# EAGLE design 555_projects_grove_i2c_ldr_revA (EAGLE 9.2.2)
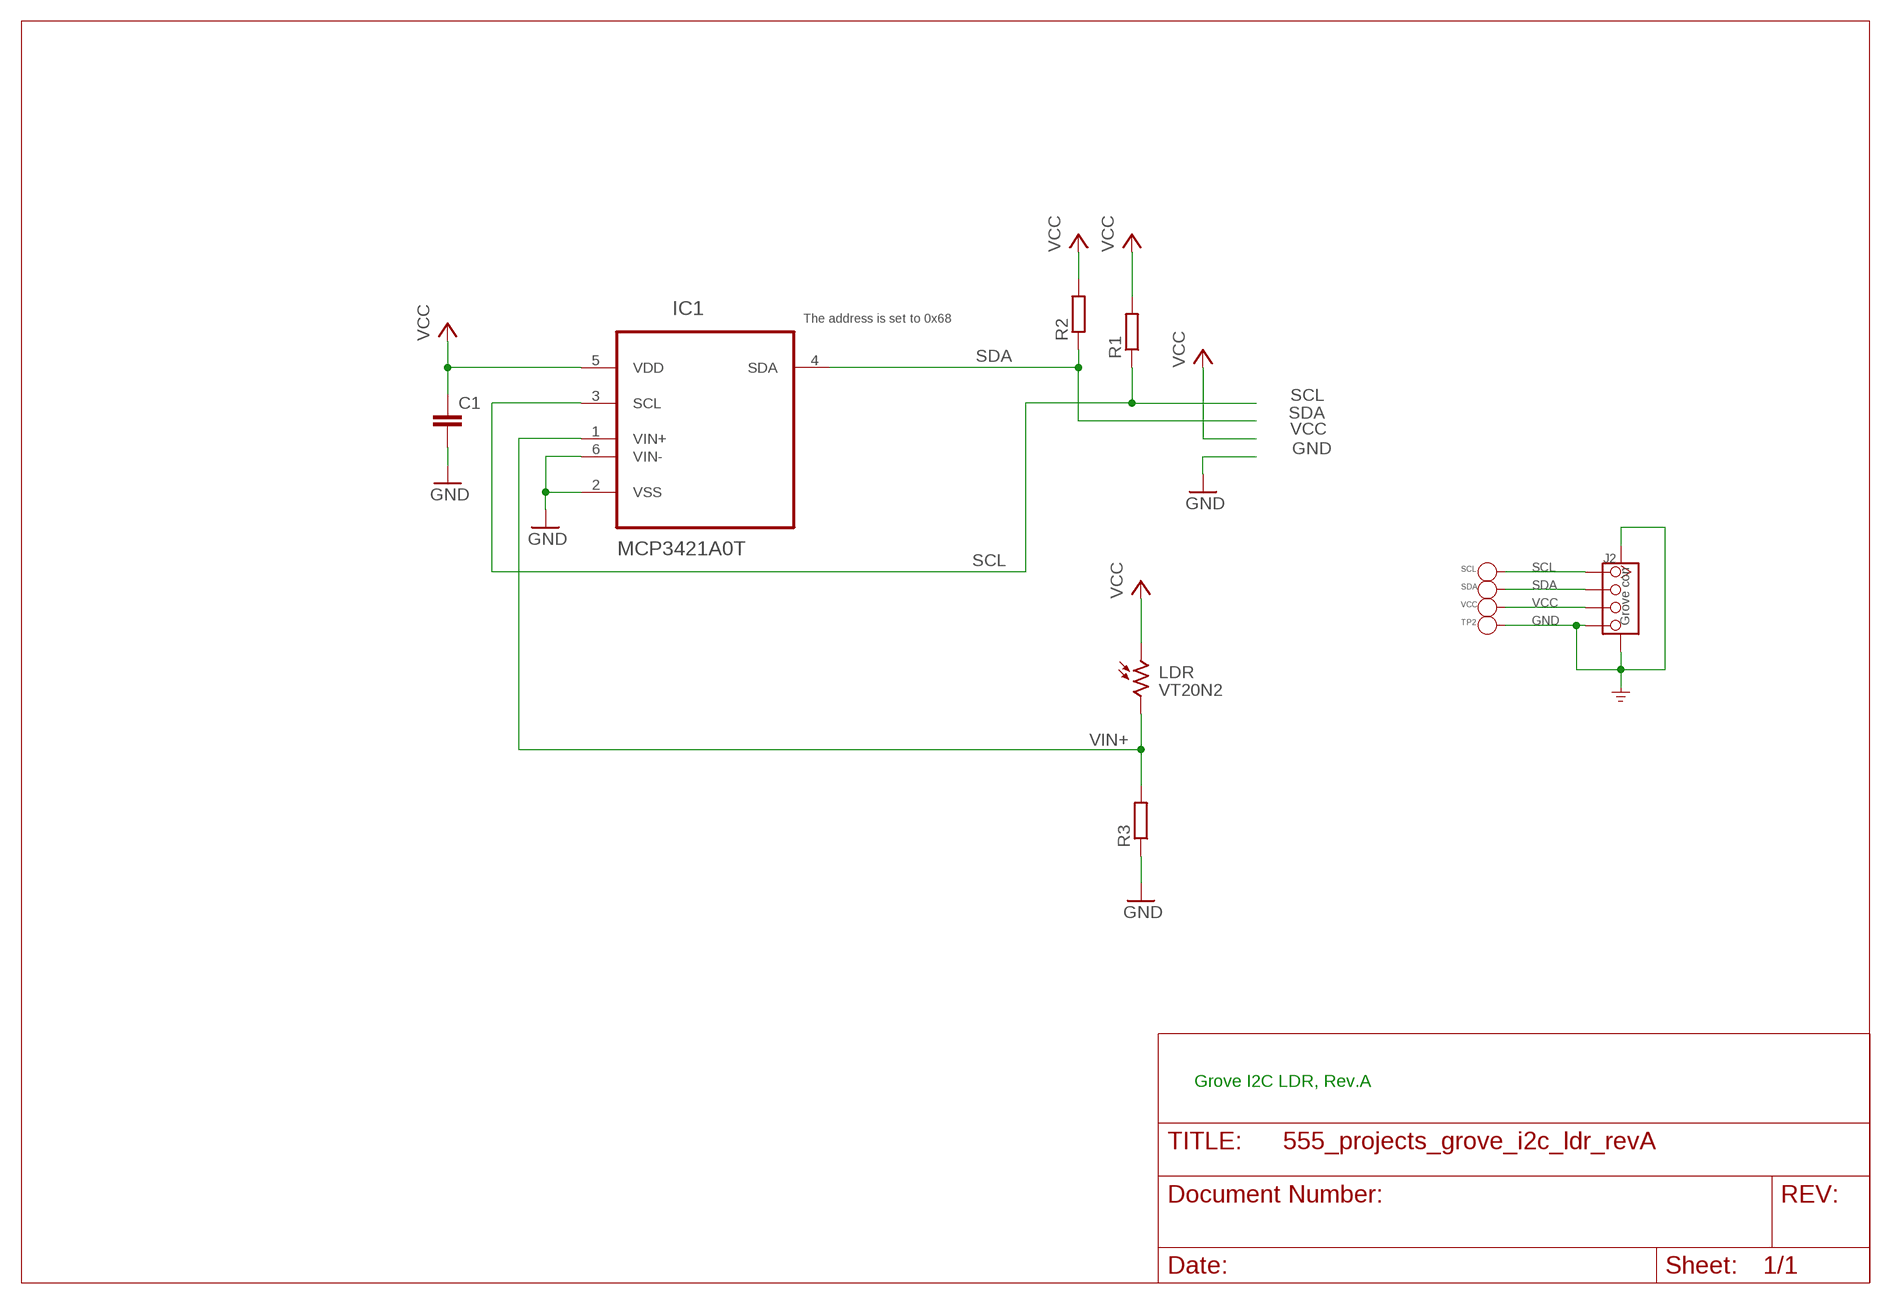
[diagram p0: schematic, sheet 1]

## Parts
C1  C-EUC0805K  [C0805K]
IC1  MCP3421A0T  MCP3421A0T-E/CH  [SOT95P270X145-6N]
J2  Grove con  TWIG-4P-2.0-SMD-FEMALE-REINFORCE'DD'  [4P-SMD-2.0]
LDR  VT20N2  [TO46-VT200]
R1  R-EU_R0805  [R0805]
R2  R-EU_R0805  [R0805]
R3  R-EU_R0805  [R0805]
SCL  TP3  PAD-TEST-POINT'4545'  [TP_4545]
SDA  TP3  PAD-TEST-POINT'4545'  [TP_4545]
TP2  PAD-TEST-POINT'4545'  [TP_4545]
VCC  TP2  PAD-TEST-POINT'4545'  [TP_4545]

## Nets
GND: C1.2 IC1.2(VSS) IC1.6(VIN-) J2.4 J2.SS1 J2.SS2 R3.1 TP2.T
SCL: IC1.3(SCL) J2.1 R1.1 SCL.T
SDA: IC1.4(SDA) J2.2 R2.1 SDA.T
VCC: C1.1 IC1.5(VDD) J2.3 LDR.1 R1.2 R2.2 VCC.T
VIN+: IC1.1(VIN+) LDR.2 R3.2

## Notes on the sheet
- The address is set to 0x68
- Grove I2C LDR, Rev.A

## Library data of the parts
C1 = resistor:C-EU: CAPACITOR, European symbol
IC1 = microchip-mcp3421:MCP3421A0T-E/CH: Analog-to-Digital Converter; MPN: MCP3421A0T-E/CH; OC_FARNELL: 1605567; OC_NEWARK: 77M2561; PACKAGE: SOT-6; SUPPLIER: Microchip
J2 = Connector :TWIG-4P-2.0-SMD-FEMALE-REINFORCE
LDR = photo-elements:VT2*: Photoconductive Cell VT200 Series Source: http://optoelectronics.perkinelmer.com/content/Datasheets/DTS_vt200seriesdatasheet.pdf
R1-R3 = resistor:R-EU_: RESISTOR, European symbol
SCL SDA TP2 VCC = Discrete:PAD-TEST-POINT; PARTNO: DNP

## Net classes
1 pwr: width 0.152 mm, drill 0.305 mm, clearance 0.152 mm

## Board
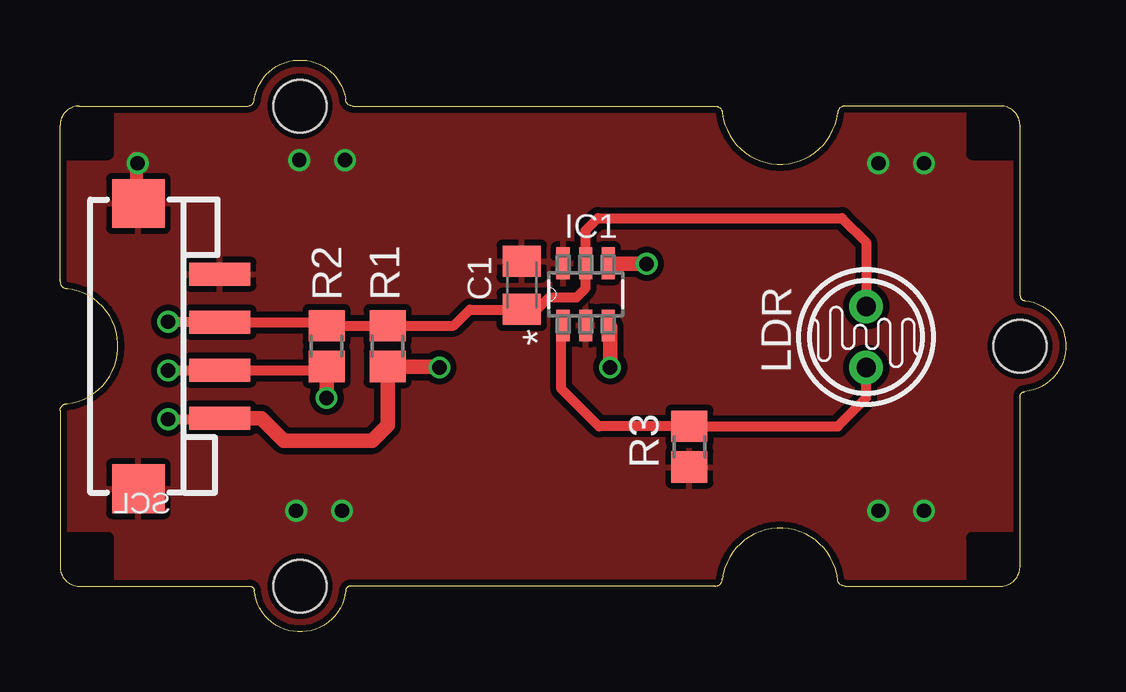
[diagram p1: board, top side]
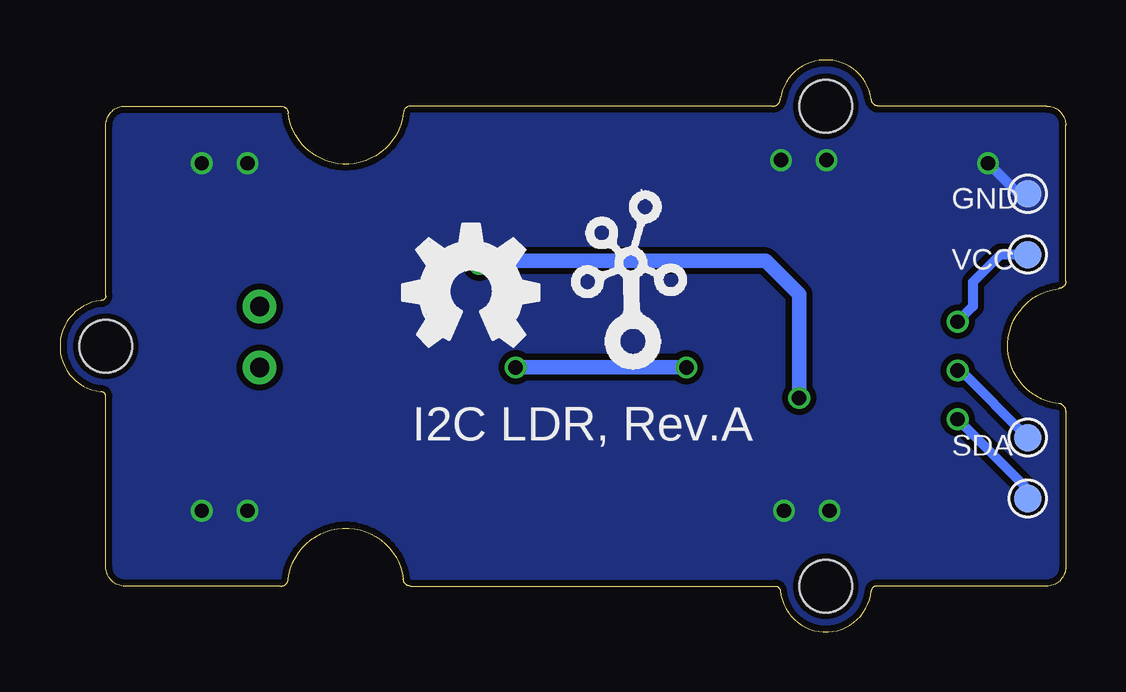
[diagram p2: board, bottom side, seen from below]

Size 41.91 x 23.83 mm. Coordinates in mm from the lower left corner, seen from the top.
Copper layers (1*16): Top 0.035mm / dielectric 1.5mm / Bottom 0.035mm
Design rules "SeeedStudio_DRU_no_angle_20130527 *": minimum track width 6mil, minimum drill 12mil, track to track 6mil, track to pad 6mil, pad to pad 6mil, via to via 6mil, smd to smd 0mil, copper to edge 10mil, drill to drill 10mil, minimum pad ring 10mil, minimum via ring 6mil, stop-mask expansion 2mil, vias tented up to drill 100mil, thermal gap 10mil

### Footprints (pad centres in the part's own frame; a part is rotated, then mirrored left to right if it is on the bottom)
C0805K = smd 1.3 x 1.6: 1 -1,0; 2 1,0
SOT95P270X145-6N = smd 1.321 x 0.559: 1 -1.295,0.94; 2 -1.295,0; 3 -1.295,-0.94; 4 1.295,-0.94; 5 1.295,0; 6 1.295,0.94
4P-SMD-2.0 = smd 0.965 x 2.54: 1 -3,0; 2 -1,0; 3 1,0; 4 3,0 | smd 2.032 x 2.184: SS1 -5.946,3.4; SS2 5.946,3.4
TO46-VT200 = drill 0.8 pad 1.4: 1 -1.27,0; 2 1.27,0
R0805 = smd 1.3 x 1.5: 1 -0.85,0; 2 0.85,0
TP_4545 = smd 1.143 x 1.143: T 0,0
GROVE-2CONNECTOR-SMD = hole 2.2: -10,-10; -10,10; 20,0

### Placement (x,y rotation side)
C1  19.24,14.45 90 top
IC1  21.91,14.07 90 top
J2  6.67,11.91 90 top
LDR  33.59,12.29 270 top
R1  13.65,11.91 90 top
R2  11.11,11.91 90 top
R3  26.22,7.72 90 top
SCL  1.59,5.56 0 bottom
SDA  1.59,8.1 0 bottom
TP2  1.59,18.26 0 bottom
U$9  [GROVE-2CONNECTOR-SMD]  20,11.91 0 top
U$11  [TWIGLOGO]  18.09,11.91 0 bottom
U$12  [OSHW_FILLX200_NOTEXT]  27.62,11.91 0 bottom
VCC  1.59,15.72 0 bottom

### Tracks (layer width: path | path; a pad name or v marks a point on that pad's centre or on a via)
GND  (via drill 0.6)
  Top 0.406: v3.24,19.53 3.24,17.88 J2.SS2 | 3.11,19.78 3.11,18.14
  Bottom 0.406: TP2.T 1.97,18.26 v3.24,19.53
  other vias: 9.97,19.66 11.87,19.66 9.84,5.05 11.75,5.05 34.1,19.53 36,19.53 34.1,5.05 36,5.05
  pour Top (isolate 0.254): -0.95,23.97 42.86,23.97 42.86,-0.79 -0.95,-0.79
  pour Bottom (isolate 0.254): -0.95,23.97 42.86,23.97 42.86,-0.79 -0.95,-0.79
SCL  (via drill 0.6)
  Top 0.406: v4.51,8.86 6.62,8.86 J2.1
  Top 0.61: v15.81,11.02 15.77,11.06 R1.1 13.65,8.61 13.02,7.97 9.33,7.97 8.4,8.91 J2.1 | v22.92,11.02 22.92,12.7 IC1.3
  Bottom 0.406: SCL.T 1.59,5.94 v4.51,8.86
  Bottom 0.61: v15.81,11.02 v22.92,11.02
SDA  (via drill 0.6)
  Top 0.406: R2.1 10.96,10.91 J2.2 6.65,10.89 v4.51,10.89
  Top 0.61: R2.1 v11.11,9.75 | v24.45,15.34 22.87,15.34 IC1.4
  Bottom 0.406: v4.51,10.89 4.38,10.89 SDA.T
  Bottom 0.61: v11.11,9.75 11.11,14.07 12.51,15.46 24.32,15.46 v24.45,15.34
VCC  (via drill 0.6)
  Top 0.406: LDR.1 33.59,16.23 32.57,17.24 22.41,17.24 21.91,16.73 IC1.5 21.91,14.32 21.52,13.94 20.38,13.94 19.89,13.45 C1.1 19.22,13.43 17.08,13.43 16.41,12.76 R1.2 R2.2 11.11,12.91 J2.3 6.65,12.92 v4.51,12.92
  Bottom 0.406: VCC.T 2.73,15.72 3.87,14.58 3.87,13.56 v4.51,12.92
VIN+
  Top 0.406: IC1.1 20.89,12.7 20.89,10.13 22.45,8.57 R3.2 32.41,8.57 33.59,9.75 LDR.2

### Text on the board
bPlace: GND | I2C LDR, Rev.A
tEnhance: Top Enhance 0.25~0.28mm
bEnhance: Bottom Enhance
bEnHoles: Holes on Bottom Enhance | All Holes are 70mil diameter